# EAGLE design robosmoker (EAGLE 7.4.0)
http://github.com/robosmoker
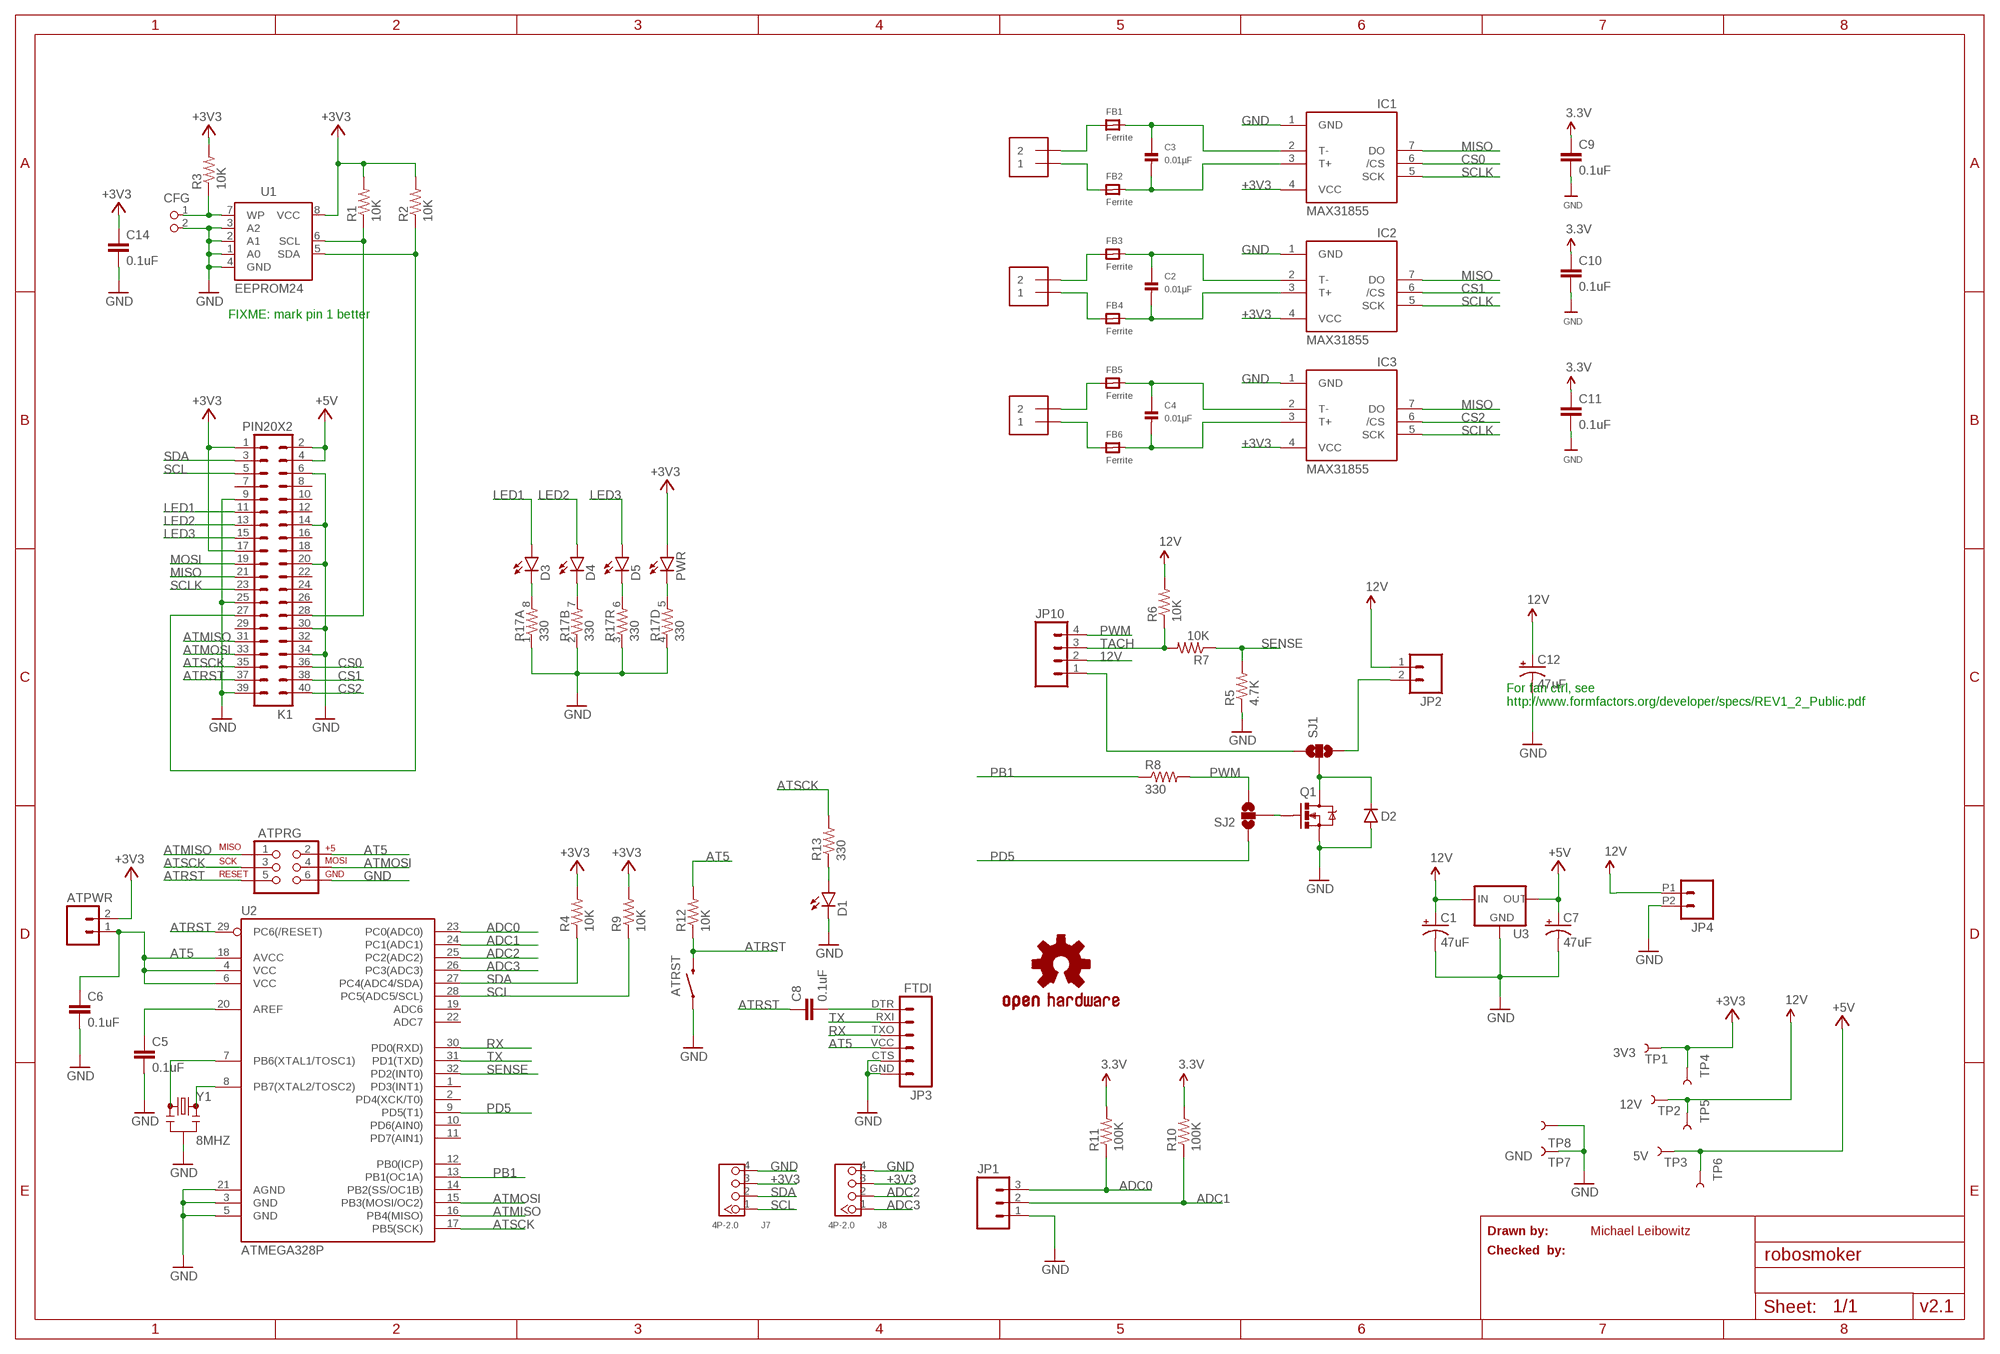
[diagram p0: schematic, sheet 1]

## Parts
ATPRG  AVR_SPI_PRG_62X3_LOCK  [2X3_LOCK]
ATPWR  M02LOCK  [1X02_LOCK]
ATRST  SWITCH-MOMENTARY-2PTH  [TACTILE-PTH]
C1  47uF  CAP_POL7343  [EIA7343]
C2  0.01µF  CAP_CERAMIC_0805  [_0805]
C3  0.01µF  CAP_CERAMIC_0805  [_0805]
C4  0.01µF  CAP_CERAMIC_0805  [_0805]
C5  0.1uF  0.1UF-25V(+80/-20%)(0603)  [0603-CAP]
C6  0.1uF  0.1UF-25V(+80/-20%)(0603)  [0603-CAP]
C7  47uF  CAP_POL7343  [EIA7343]
C8  0.1uF  0.1UF-25V(+80/-20%)(0603)  [0603-CAP]
C9  0.1uF  CAP0805  [0805]
C10  0.1uF  CAP0805  [0805]
C11  0.1uF  CAP0805  [0805]
C12  47uF  CAP_POL7343  [EIA7343]
C14  0.1uF  CAP0805  [0805]
CFG  PIN2_100  [PIN_W_2]
D1  LED0603  [LED-0603]
D2  250mA  DIODEBAS16  [SOD-323]
D3  LED0603  [LED-0603]
D4  LED0603  [LED-0603]
D5  LED0603  [LED-0603]
FB1  Ferrite  FERRITE_0805  [_0805]
FB2  Ferrite  FERRITE_0805  [_0805]
FB3  Ferrite  FERRITE_0805  [_0805]
FB4  Ferrite  FERRITE_0805  [_0805]
FB5  Ferrite  FERRITE_0805  [_0805]
FB6  Ferrite  FERRITE_0805  [_0805]
IC1  MAX31855  MAX6675  [SO08]
IC2  MAX31855  MAX6675  [SO08]
IC3  MAX31855  MAX6675  [SO08]
J1  1X2-3.5MM  [1X2-3.5MM]
J2  1X2-3.5MM  [1X2-3.5MM]
J3  1X2-3.5MM  [1X2-3.5MM]
J7  4P-2.0  GROVE-CONNECTOR-DIP(4P-2.0)  [HW4-2.0]
J8  4P-2.0  GROVE-CONNECTOR-DIP(4P-2.0)  [HW4-2.0]
JP1  M03SCREW  [SCREWTERMINAL-3.5MM-3]
JP2  M02POLAR_LOCK  [MOLEX-1X2_LOCK]
JP3  FTDI  FTDI_BASICPTH  [FTDI_BASIC]
JP4  M022.54MM_SCREWTERM  [1X02_2.54_SCREWTERM]
JP10  M04POLAR_LOCK  [MOLEX-1X4_LOCK]
K1  PIN20X2  [PIN_20X2]
LOGO1  OSHW-LOGOM  [OSHW-LOGO-M]
PWR  LED0603  [LED-0603]
Q1  NFET-FDD8780  MOSFET-NCHANNELFDD8780  [DPAK]
R1  10K  10KOHM-1/10W-1%(0603)0603  [0603-RES]
R2  10K  10KOHM-1/10W-1%(0603)0603  [0603-RES]
R3  10K  10KOHM-1/10W-1%(0603)0603  [0603-RES]
R4  10K  10KOHM-1/10W-1%(0603)0603  [0603-RES]
R5  4.7K  4.7KOHM-1/10W-1%(0603)  [0603-RES]
R6  10K  10KOHM-1/10W-1%(0603)0603  [0603-RES]
R7  10K  10KOHM-1/10W-1%(0603)0603  [0603-RES]
R8  330  RESISTOR0603  [0603-RES]
R9  10K  10KOHM-1/10W-1%(0603)0603  [0603-RES]
R10  100K  10KOHM-1/10W-1%(0603)0603  [0603-RES]
R11  100K  10KOHM-1/10W-1%(0603)0603  [0603-RES]
R12  10K  10KOHM-1/10W-1%(0603)0603  [0603-RES]
R13  330  RESISTOR0603  [0603-RES]
R17  330  RESISTOR-ARRAY0603-ARV  [0603-ARV]
SJ1  SOLDERJUMPER_2WAYS  [SJ_3]
SJ2  SOLDERJUMPER_2WAYS  [SJ_3]
TP1  3V3  TEST-POINT3X4  [PAD.03X.04]
TP2  12V  TEST-POINT3X4  [PAD.03X.04]
TP3  5V  TEST-POINT3X4  [PAD.03X.04]
TP4  3V3  TEST-POINTTP_15TH_THRU  [TP_15TH]
TP5  3V3  TEST-POINTTP_15TH_THRU  [TP_15TH]
TP6  3V3  TEST-POINTTP_15TH_THRU  [TP_15TH]
TP7  GND  TEST-POINT3X4  [PAD.03X.04]
TP8  3V3  TEST-POINTTP_15TH_THRU  [TP_15TH]
U1  EEPROM24  [SOIC8]
U2  ATMEGA328P  ATMEGA328P_TQFP  [TQFP32-08]
U3  V_REG_78XXSINK  [TO220-IGO]
Y1  8MHZ  RESONATOR8MHZ  [RESONATOR-SMD]

## Nets
12V [power]: C1.A(+) C12.A(+) JP2.1 JP4.P1 JP10.2 R6.2 TP2.P$1 TP5.P$1 U3.IN
+3V3 [power]: ATPWR.2 C9.1 C10.1 C11.1 C14.1 IC1.4(VCC) IC2.4(VCC) IC3.4(VCC) J7.3 J8.3 K1.1 K1.17 PWR.A R1.2 R2.2 R3.2 R4.2 R9.2 R10.2 R11.2 TP1.P$1 TP4.P$1 U1.8(VCC) ; supply symbol labelled 3.3V
+5V [power]: C7.A(+) K1.2 K1.4 TP3.P$1 TP6.P$1 U3.OUT
ADC0: JP1.3 R11.1 U2.23(PC0(ADC0))
ADC1: JP1.2 R10.1 U2.24(PC1(ADC1))
ADC2: J8.2 U2.25(PC2(ADC2))
ADC3: J8.1 U2.26(PC3(ADC3))
AT5 [power]: ATPRG.2 ATPWR.1 C6.1 JP3.VCC R12.2 U2.4(VCC) U2.6(VCC) U2.18(AVCC)
ATMISO: ATPRG.1 K1.31 U2.16(PB4(MISO))
ATMOSI: ATPRG.4 K1.33 U2.15(PB3(MOSI/OC2))
ATRST: ATPRG.5 ATRST.3 C8.1 K1.37 R12.1 U2.29(PC6(/RESET))
ATSCK: ATPRG.3 K1.35 R13.2 U2.17(PB5(SCK))
CS0: IC1.6(/CS) K1.36
CS1: IC2.6(/CS) K1.38
CS2: IC3.6(/CS) K1.40
GND [power]: ATPRG.6 ATRST.1 C1.C(-) C5.2 C6.2 C7.C(-) C9.2 C10.2 C11.2 C12.C(-) C14.2 CFG.2 D1.C D2.A IC1.1(GND) IC2.1(GND) IC3.1(GND) J7.4 J8.4 JP1.1 JP3.CTS JP3.GND JP4.P2 K1.6 K1.9 K1.14 K1.20 K1.25 K1.30 K1.34 K1.39 Q1.3(S) R5.1 R17.1 R17.2 R17.3 R17.4 TP7.P$1 TP8.P$1 U1.1(A0) U1.2(A1) U1.3(A2) U1.4(GND) U2.3(GND) U2.5(GND) U2.21(AGND) U3.GND Y1.2
LED1: D3.A K1.11
LED2: D4.A K1.13
LED3: D5.A K1.15
MISO: IC1.7(DO) IC2.7(DO) IC3.7(DO) K1.21
MOSI: K1.19
N$1: K1.28 R1.1 U1.6(SCL)
N$2: K1.27 R2.1 U1.5(SDA)
N$3: CFG.1 R3.1 U1.7(WP)
N$4: FB1.1 J1.2
N$5: C3.1 FB1.2 IC1.2(T-)
N$6: FB2.1 J1.1
N$7: C3.2 FB2.2 IC1.3(T+)
N$8: FB3.1 J2.2
N$9: C2.1 FB3.2 IC2.2(T-)
N$10: FB4.1 J2.1
N$11: C2.2 FB4.2 IC2.3(T+)
N$12: FB5.1 J3.2
N$13: C4.1 FB5.2 IC3.2(T-)
N$14: FB6.1 J3.1
N$15: C4.2 FB6.2 IC3.3(T+)
N$16 [power]: JP2.2 SJ1.3
N$17 [power]: JP10.1 SJ1.1
N$18: C5.1 U2.20(AREF)
N$19: C8.2 JP3.DTR
N$20: D1.A R13.1
N$21: D3.C R17.8
N$22 [power]: D2.C Q1.4(D) SJ1.2
N$23: D4.C R17.7
N$24: D5.C R17.6
N$25: Q1.1(G) SJ2.2
N$26: U2.7(PB6(XTAL1/TOSC1)) Y1.1
N$27: U2.8(PB7(XTAL2/TOSC2)) Y1.3
PB1: R8.1 U2.13(PB1(OC1A))
PD5: SJ2.1 U2.9(PD5(T1))
PWM: JP10.4 R8.2 SJ2.3
PWR: PWR.C R17.5
RX: JP3.TXO U2.30(PD0(RXD))
SCL: J7.1 K1.5 R9.1 U2.28(PC5(ADC5/SCL))
SCLK: IC1.5(SCK) IC2.5(SCK) IC3.5(SCK) K1.23
SDA: J7.2 K1.3 R4.1 U2.27(PC4(ADC4/SDA))
SENSE: R5.2 R7.1 U2.32(PD2(INT0))
TACH: JP10.3 R6.1 R7.2
TX: JP3.RXI U2.31(PD1(TXD))
Unconnected: K1.7 K1.8 K1.10 K1.12 K1.16 K1.18 K1.22 K1.24 K1.26 K1.29 K1.32 U2.1(PD3(INT1)) U2.2(PD4(XCK/T0)) U2.10(PD6(AIN0)) U2.11(PD7(AIN1)) U2.12(PB0(ICP)) U2.14(PB2(SS/OC1B)) U2.19(ADC6) U2.22(ADC7)

## Notes on the sheet
- FIXME: mark pin 1 better
- For fan ctrl, see
  http://www.formfactors.org/developer/specs/REV1_2_Public.pdf
- Drawn by: | Michael Leibowitz
- Checked  by:
- v2.1

## Library data of the parts
ATPRG = SparkFun-Connectors:AVR_SPI_PRG_6: AVR ISP 6 Pin This is the reduced ISP connector for AVR programming. Common on Arduino. This footprint will take up less PCB space and can be used with a 10-pin to 6-pin adapter such as SKU: BOB-08508 **Special note about "TEST_POINT" package. The stop mask is on the top side, so if you want your programming test points to be on the bottom of your board, make sure to place this package on the bottom side of the board. This also ensure that the orientation to program from the bottom side will be correct.
ATPWR JP2 JP4 = SparkFun-Connectors:M02: Standard 2-pin 0.1" header. Use with - straight break away headers ( PRT-00116) - right angle break away headers (PRT-00553) - swiss pins (PRT-00743) - machine pins (PRT-00117) - female headers (PRT-00115) Molex polarized connector foot print use with: PRT-08233 with associated crimp pins and housings. 2.54_SCREWTERM for use with PRT-10571. 3.5mm Screw Terminal footprints for PRT-08084 5mm Screw Terminal footprints for use with PRT-08432
ATRST = SparkFun-Electromechanical:SWITCH-MOMENTARY-2: Various NO switches- pushbuttons, reed, etc; PROD_ID: SWCH-08441
C1 C7 C12 = SparkFun-Capacitors:CAP_POL: Capacitor Polarized These are standard SMD and PTH capacitors. Normally 10uF, 47uF, and 100uF in electrolytic and tantalum varieties. Always verify the external diameter of the through hole cap, it varies with capacity, voltage, and manufacturer. The EIA devices should be standard.; PROD_ID: CAP-08702
C2-C4 = microbuilder:CAP_CERAMIC: Ceramic Capacitors 0402 - 0402 Surface Mount Capacitors 16pF 50V 5% [Digikey: 445-4899-2-ND] 18pF 50V 5% [Digikey: 490-1281-2-ND] 22pF 50V 5% [Digikey: 490-1283-2-ND] 68pF 50V 5% [Digikey: 490-1289-2-ND] 0.1uF 10V 10% [Digikey: 490-1318-2-ND] 1.0uF 6.3V 10% [Digikey: 490-1320-2-ND] 0603 - 0603 Surface Mount Capacitors 16 pF 50V 5% [Digikey: 445-5051-2-ND] 22 pF 50V [Digikey: PCC220ACVTR-ND] 33 pF 50V 5% [Digikey: 490-1415-1-ND] 56pF 50V 5% [Digikey: 490-1421-1-ND] 220pF 50V 5% [Digikey: 445-1285-1-ND] 680 pF 50V 2200 pF 50V 5% C0G [Digikey: 445-1297-1-ND] 5600 pF 100V 5% X7R [Digikey: 478-3711-1-ND] 0.1 µF 25V 10% [Digikey: PCC2277TR-ND] 0.22 µF 16V 10% X7R [Digikey: 445-1318-1-ND] 1.0 µF 25V 10% [Digikey: 445-5146-2-ND] 0603 - RF Specific 3pF 250V +/-0.1pF RF [Digikey: 712-1347-1-ND] 18 pF 250V 5% [Digikey: 478-3505-1-ND or 712-1322-1-ND] 56 pF 250V 5% C0G RF [Digikey: 490-4867-1-ND] 68 pF 250V RF [Digikey: 490-4868-1-ND] 0805 - 0805 Surface Mount Capacitors 220 pF 250V 2% RF Ceramic Capacitor [Digikey: 712-1398-1-ND] 1000 pF 50V 2% NP0 Ceramic Capacitor [Digikey: 478-3760-1-ND] 0.1 µF 25V 10% Ceramic Capacitor [Digikey: PCC1828TR-ND] 1.0 µF 16V 10% Ceramic Capacitor[Digikey: 490-1691-2-ND] 10.0 µF 10V 10% Ceramic Capacitor[Digikey: 709-1228-1-ND] 10.0 uF 16V 10% Ceramic Capacitor [Digikey: 478-5165-2-ND] 47 uF 6.3V 20% Ceramic Capacitor [Digikey: 587-1779-1-ND or 399-5506-1-ND] 1206 - 1206 Surface Mount Capacitors 47uF 10V 20% Ceramic Capacitor [Digikey: 490-5528-1-ND or 399-5508-1-ND or 445-6010-1-ND] 100uF 6.3V -20%, +80% Y5V Ceramic Capacitor (Digikey: 490-4512-1-ND, Mouser: 81-GRM31CF50J107ZE1L)
C5 C6 C8 = SparkFun-Capacitors:0.1UF-25V(+80/-20%)(0603): CAP-00810 Ceramic Standard decoupling cap; PROD_ID: CAP-00810
C9-C11 C14 = SparkFun-Passives:CAP: Capacitor Standard 0603 ceramic capacitor, and 0.1" leaded capacitor.
CFG = FLYFISH:PIN2
D1 D3-D5 PWR = SparkFun-LED:LED: LEDs Standard schematic elements and footprints for 5mm, 3mm, 1206, and 0603 sized LEDs. 5mm - Spark Fun Electronics SKU : COM-00529 (and others)
D2 = SparkFun-DiscreteSemi:DIODE: Diode These are standard reverse protection diodes and small signal diodes. SMA package can handle up to about 1A. SOD-323 can handle about 200mA. What the SOD-323 package when ordering, there are some mfgs out there that are 5-pin packages.; PROD_ID: DIO-09646; VALUE: 250mA/100V
FB1-FB6 = microbuilder:FERRITE: Ferrite Bead 0603 MMZ1608B121C - 120 Ohm @ 100MHz, 600mA, 0.15 Ohm DC Resistance - Digikey: 445-2164-1-ND BK1608HW121-T - 120 Ohm, 600mA Ferrite Chip - Digikey: 587-1876-2-ND 0805 HZ0805B272R-10 - 2.7K Ohm @ 100MHz, 200mA, 0.8 Ohm DC Resistance - Digikey: 240-2504-1-ND (see also Murata BLM21BD272SN1L) MMZ2012Y152B - 1.5K Ohm @ 100MHz, 500mA, 0.4 Ohm DC Resistance - Digikey: 445-1560-1-ND - Mainly for high frequency (80-400MHz) MMZ2012R102A - 1K Ohm @ 100MHz, 500mA, 0.3 Ohm DC Resistance - Digikey: 445-1555-2-ND - More general purpose (10-200MHz)
IC1-IC3 = adafruit:MAX6675
J1-J3 = adafruit:1X2: 3.5mm Terminal block http://www.ladyada.net/library/pcb/eaglelibrary.html
J7 J8 = Seeed-OPL-Connector:GROVE-CONNECTOR-DIP(4P-2.0): 320110033
JP1 = SparkFun-Connectors:M03: Header 3 Standard 3-pin 0.1" header. Use with straight break away headers (SKU : PRT-00116), right angle break away headers (PRT-00553), swiss pins (PRT-00743), machine pins (PRT-00117), and female headers (PRT-00115). Molex polarized connector foot print use with SKU : PRT-08232 with associated crimp pins and housings.; PROD_ID: CONN-08288
JP3 = SparkFun-Connectors:FTDI_BASIC: FTDI Basic header with labels
JP10 = SparkFun-Connectors:M04: Header 4 Standard 4-pin 0.1" header. Use with straight break away headers (SKU : PRT-00116), right angle break away headers (PRT-00553), swiss pins (PRT-00743), machine pins (PRT-00117), and female headers (PRT-00115). Molex polarized connector foot print use with SKU : PRT-08231 with associated crimp pins and housings. 1MM SMD Version SKU: PRT-10208
K1 = FLYFISH:PIN20X2
LOGO1 = SparkFun-Aesthetics:OSHW-LOGO: Open Source Hardware Logo This logo indicates the piece of hardware it is found on incorporates a OSHW license and/or adheres to the definition of open source hardware found here: http://freedomdefined.org/OSHW
Q1 = SparkFun-DiscreteSemi:MOSFET-NCHANNEL: Common NMOSFET Parts MFG P/N Store ID Prod ID FDD8780 TRANS-09984 SI7820DN TRANS-11055 FDS6630A IC-08089 2N7002PW TRANS-11151 FQP30N06L COM-10213 TRANS-10060 BSS123LT1G TRANS-08345 BSS138 TRANS-00830 BS170 2N7000; PROD_ID: TRANS-09984
R1-R4 R6 R7 R9 R12 = SparkFun-Resistors:10KOHM-1/10W-1%(0603): RES-00824; PROD_ID: RES-00824
R5 = SparkFun-Resistors:4.7KOHM-1/10W-1%(0603): RES-07857; PROD_ID: RES-07857
R8 R13 = SparkFun-Resistors:RESISTOR: Resistor Basic schematic elements and footprints for 0603, 1206, and PTH resistors.
R10 R11 = SparkFun-Resistors:10KOHM-1/10W-1%(0603): RES-00824; PROD_ID: RES-00824; VALUE: 10K
R17 = SparkFun-Resistors:RESISTOR-ARRAY: Array Chip Resistor Source: RS Component / Phycomp
SJ1 SJ2 = SparkFun-Retired:SOLDERJUMPER_2WAY: Solder Jumper 2 way solder jumper
TP1-TP8 = SparkFun-Passives:TEST-POINT: Bare copper test points for troubleshooting or ICT
U1 = FLYFISH:EEPROM24
U2 = SparkFun-DigitalIC:ATMEGA328P_TQFP; PROD_ID: IC-09069; VALUE: ATMEGA328P_TQFP
U3 = SparkFun-PowerIC:V_REG_78XX: Voltage Regulator Standard 78xx regulator. IGO (Input Ground Output). Spark Fun Electronics SKU : COM-00107
Y1 = SparkFun-FreqCtrl:RESONATOR: Resonator Small SMD resonator. Used, eg, on the Arduino Pro/ Pro Mini boards. 8MHz- XTAL-08895 16MHz- XTAL-08900; PROD_ID: XTAL-08895

## Net classes
1 power: width 0.305 mm

## Board
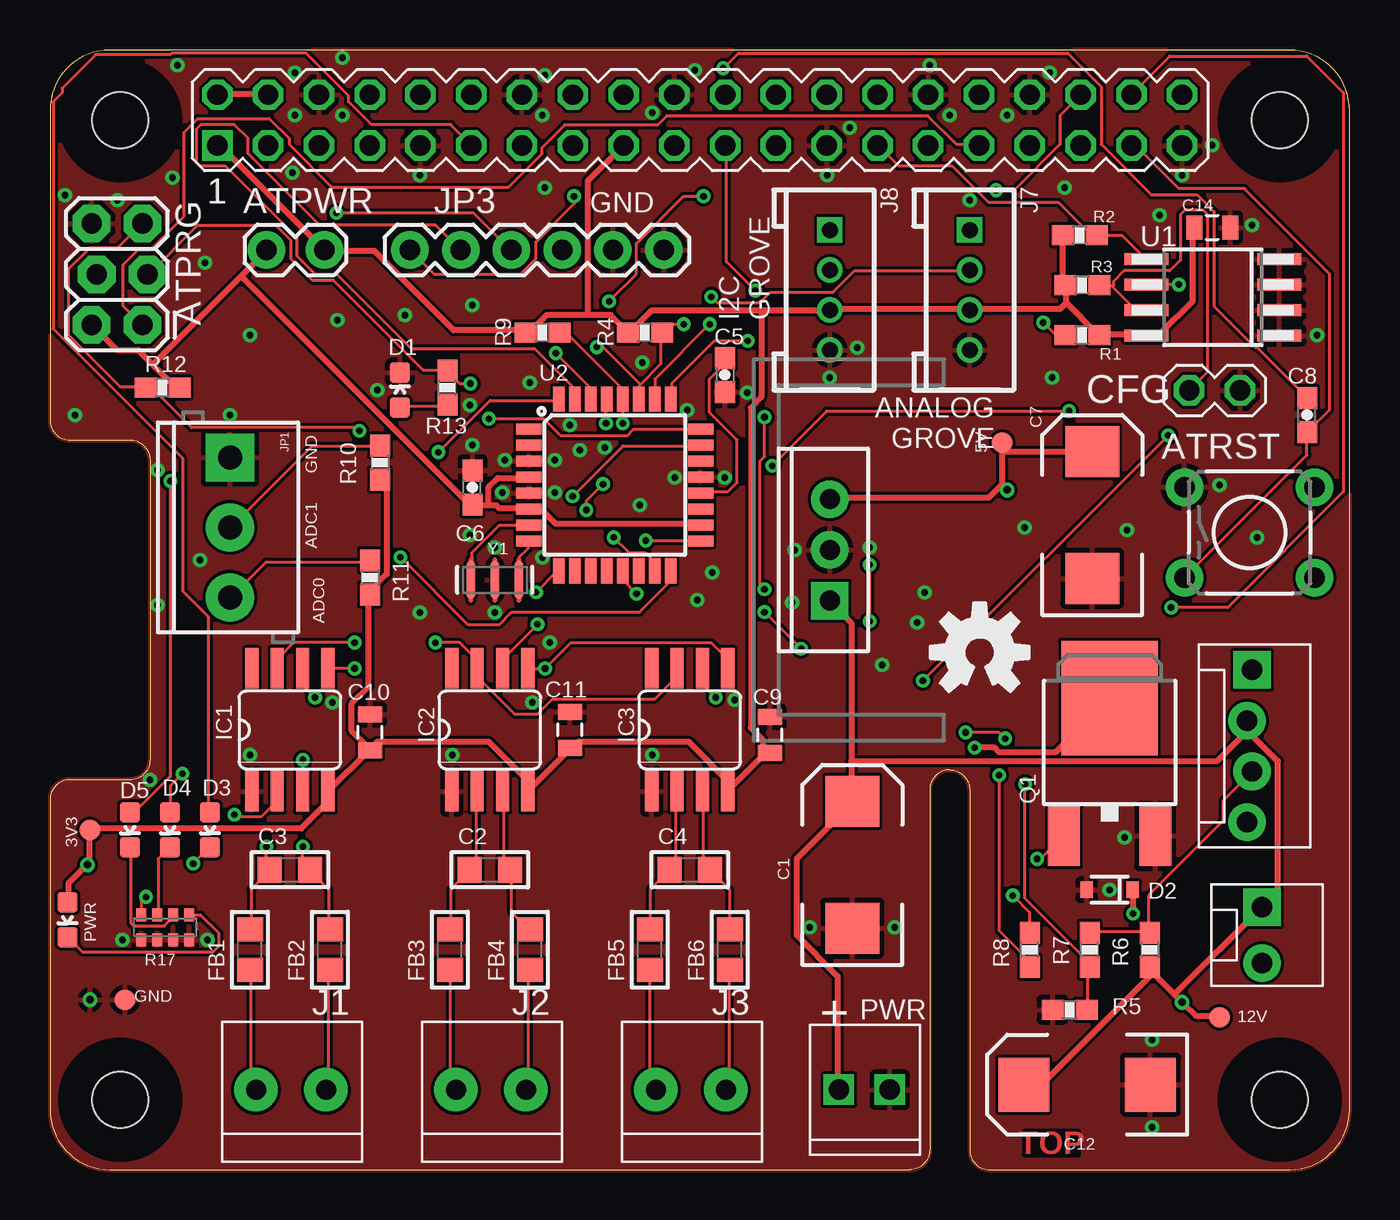
[diagram p1: board, top side]
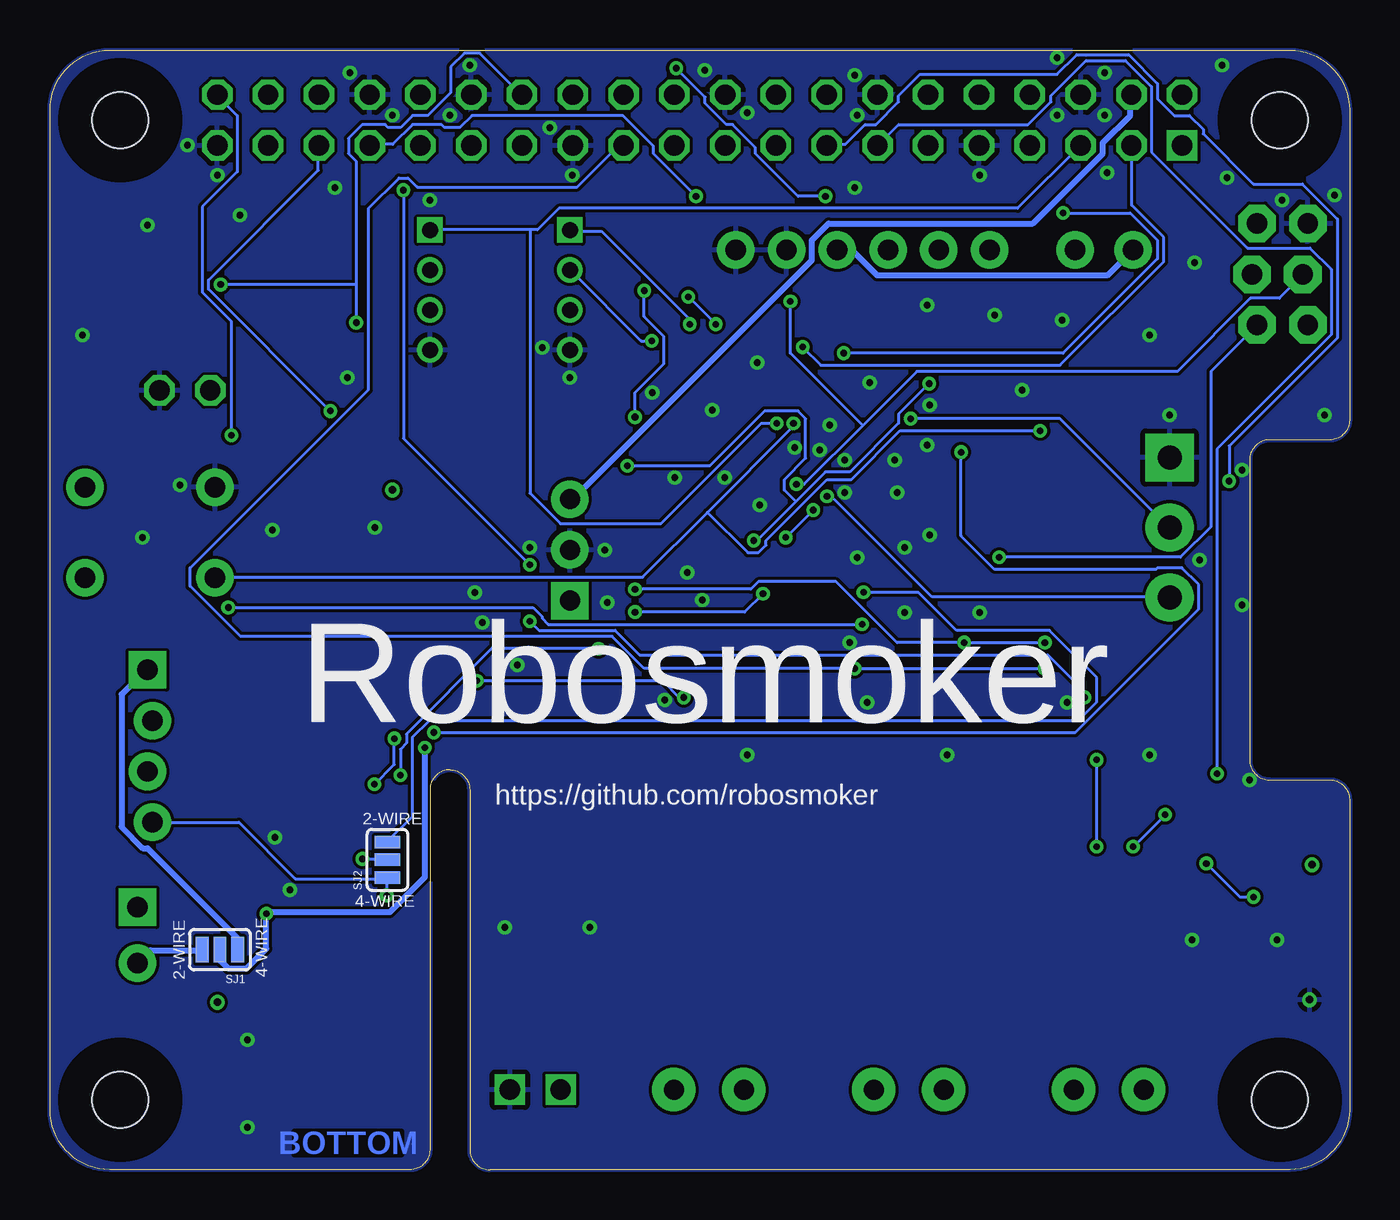
[diagram p2: board, bottom side, seen from below]

Size 65 x 56 mm. Coordinates in mm from the lower left corner, seen from the top.
Outline: 0,3 arc90 3,0 43,0 arc90 44,1 44,19 arc-90 45,20 arc-90 46,19 46,1 arc90 47,0 62,0 arc90 65,3 65,53 arc90 62,56 3,56 arc90 0,53 0,37.5 arc90 1,36.5 4,36.5 arc-90 5,35.5 5,20.5 arc-90 4,19.5 1,19.5 arc90 0,18.5 0,3
Copper layers (1*16): Top 0.0356mm / dielectric 1.5011mm / Bottom 0.0356mm
Design rules "LaenPCBOrder *": minimum track width 6mil, minimum drill 13mil, track to track 6mil, track to pad 6mil, pad to pad 6mil, via to via 6mil, smd to smd 6mil, copper to edge 0mil, drill to drill 6mil, minimum pad ring 7mil, minimum via ring 7mil, stop-mask expansion 3mil, vias tented up to drill 15mil, thermal gap 10mil
Holes 2.8 mm at 3.5,3.5 3.5,52.5 61.5,52.5 61.5,3.5
tRestrict: area 1.9,51 to 5,54; area 60,51 to 63,54; area 60,1.9 to 63,5; area 1.9,1.9 to 5,5
bRestrict: area 1.9,1.9 to 5,5; area 1.9,51 to 5,54; area 60,1.9 to 63,5; area 60,51 to 63,54

### Footprints (pad centres in the part's own frame; a part is rotated, then mirrored left to right if it is on the bottom)
2X3_LOCK = drill 1.016 pad 1.88 octagon: 1 0,0; 2 0,2.54; 3 2.54,-0.254; 4 2.54,2.286; 5 5.08,0; 6 5.08,2.54
1X02_LOCK = drill 1.016 pad 1.88: 1 -0.178,0; 2 2.718,0
TACTILE-PTH = drill 1.016 pad 1.88: 1 -3.251,2.261; 2 3.251,2.261; 3 -3.251,-2.261; 4 3.251,-2.261
EIA7343 = smd 2.55 x 2.7: A 3.17,0; C -3.17,0
_0805 = smd 1.2 x 1.3: 1 -1.016,0; 2 1.016,0
0603-CAP = smd 1.1 x 1: 1 -0.85,0; 2 0.85,0
0805 = smd 0.8 x 1.2: 1 -0.9,0; 2 0.9,0
PIN_W_2 = drill 1.016 octagon: 1 0,0; 2 0,-2.54
LED-0603 = smd 1 x 1: A 0,-0.877; C 0,0.877
SOD-323 = smd 0.63 x 0.83: A 1.15,0; C -1.15,0
SO08 = smd 0.66 x 2.032: 1 -1.905,-3.073; 2 -0.635,-3.073; 3 0.635,-3.073; 4 1.905,-3.073; 5 1.905,3.073; 6 0.635,3.073; 7 -0.635,3.073; 8 -1.905,3.073
1X2-3.5MM = drill 1 pad 2.184: 1 1.8,0; 2 -1.7,0
HW4-2.0 = drill 0.8 pad 1.27 square: 1 -3,0 | drill 0.8 pad 1.27: 2 -1,0; 3 1,0; 4 3,0
SCREWTERMINAL-3.5MM-3 = drill 1.2 pad 2.413 square: 1 0,0 | drill 1.2 pad 2.413: 2 3.5,0; 3 7,0
MOLEX-1X2_LOCK = drill 1.016 pad 1.88 square: 1 -0.127,0 | drill 1.016 pad 1.88: 2 2.667,0
FTDI_BASIC = drill 1.016 pad 1.88: CTS 10.16,0; DTR 0,0; GND 12.7,0; RXI 2.54,0; TXO 5.08,0; VCC 7.62,0
1X02_2.54_SCREWTERM = drill 1.016 square: P1 2.54,0; P2 0,0
MOLEX-1X4_LOCK = drill 1.016 pad 1.88 square: 1 0,0.127 | drill 1.016 pad 1.88: 2 2.54,-0.127; 3 5.08,0.127; 4 7.62,-0.127
PIN_20X2 = drill 1.016 square: 1 -24.13,-1.27 | drill 1.016 octagon: 2 -24.13,1.27; 3 -21.59,-1.27; 4 -21.59,1.27; 5 -19.05,-1.27; 6 -19.05,1.27; 7 -16.51,-1.27; 8 -16.51,1.27; 9 -13.97,-1.27; 10 -13.97,1.27; 11 -11.43,-1.27; 12 -11.43,1.27; 13 -8.89,-1.27; 14 -8.89,1.27; 15 -6.35,-1.27; 16 -6.35,1.27; 17 -3.81,-1.27; 18 -3.81,1.27; 19 -1.27,-1.27; 20 -1.27,1.27; 21 1.27,-1.27; 22 1.27,1.27; 23 3.81,-1.27; 24 3.81,1.27; 25 6.35,-1.27; 26 6.35,1.27; 27 8.89,-1.27; 28 8.89,1.27; 29 11.43,-1.27; 30 11.43,1.27; 31 13.97,-1.27; 32 13.97,1.27; 33 16.51,-1.27; 34 16.51,1.27; 35 19.05,-1.27; 36 19.05,1.27; 37 21.59,-1.27; 38 21.59,1.27; 39 24.13,-1.27; 40 24.13,1.27
DPAK = smd 1.6 x 3: 1 -2.28,-5.31; 3 2.28,-5.31 | smd 4.826 x 5.715: 4 0,1.588
0603-RES = smd 1.1 x 1: 1 -0.85,0; 2 0.85,0
0603-ARV = smd 0.5 x 0.65: 1 -1.2,-0.625; 2 -0.4,-0.625; 3 0.4,-0.625; 4 1.2,-0.625; 5 1.2,0.625; 6 0.4,0.625; 7 -0.4,0.625; 8 -1.2,0.625
SJ_3 = smd 0.635 x 1.27: 1 -0.889,0; 2 0,0; 3 0.889,0
PAD.03X.04 = smd 1.016 x 1.016: P$1 0,0
TP_15TH = drill 0.381 pad 0.61: P$1 0,0
SOIC8 = smd 0.6 x 2.2: 1 -1.905,-3.33; 2 -0.635,-3.33; 3 0.635,-3.33; 4 1.905,-3.33; 5 1.905,3.33; 6 0.635,3.33; 7 -0.635,3.33; 8 -1.905,3.33
TQFP32-08 = smd 1.27 x 0.559: 1 -4.293,2.8; 2 -4.293,2; 3 -4.293,1.2; 4 -4.293,0.4; 5 -4.293,-0.4; 6 -4.293,-1.2; 7 -4.293,-2; 8 -4.293,-2.8; 17 4.293,-2.8; 18 4.293,-2; 19 4.293,-1.2; 20 4.293,-0.4; 21 4.293,0.4; 22 4.293,1.2; 23 4.293,2; 24 4.293,2.8 | smd 0.559 x 1.27: 9 -2.8,-4.293; 10 -2,-4.293; 11 -1.2,-4.293; 12 -0.4,-4.293; 13 0.4,-4.293; 14 1.2,-4.293; 15 2,-4.293; 16 2.8,-4.293; 25 2.8,4.293; 26 2,4.293; 27 1.2,4.293; 28 0.4,4.293; 29 -0.4,4.293; 30 -1.2,4.293; 31 -2,4.293; 32 -2.8,4.293
TO220-IGO = drill 1 pad 1.88: GND 0,0; OUT 2.54,0 | drill 1 pad 1.88 square: IN -2.54,0
RESONATOR-SMD = smd 0.45 x 1.905: 1 -1.2,0; 2 0,0; 3 1.2,0

### Placement (x,y rotation side)
ATPRG  4.62,42.25 90 top
ATPWR  11,46 0 top
ATRST  60,31.88 0 top
C1  40.12,15.25 90 top
C2  22,15 0 top
C3  12,15 0 top
C4  32,15 0 top
C5  33.75,39.75 270 top
C6  21.12,34.12 90 top
C7  52.12,32.75 90 top
C8  62.88,37.75 90 top
C9  36,21.75 90 top
C10  16,21.88 90 top
C11  26,22 90 top
C12  51.88,4.25 180 top
C14  58.12,47.12 0 top
CFG  56.98,38.98 90 top
D1  17.5,39 0 top
D2  53,14 180 top
D3  8,17 180 top
D4  6,17 180 top
D5  4,17 180 top
FB1  10,11 90 top
FB2  14,11 90 top
FB3  20,11 90 top
FB4  24,11 90 top
FB5  30,11 90 top
FB6  34,11 90 top
IC1  12,22 0 top
IC2  22,22 0 top
IC3  32,22 0 top
J1  12,4 0 top
J2  22,4 0 top
J3  32,4 0 top
J7  46,44 270 top
J8  39,44 270 top
JP1  9,35.62 270 top
JP2  60.62,13 270 top
JP3  18,46 0 top
JP4  42,4 180 top
JP10  60,25 270 top
K1  32.5,52.5 0 top
LOGO1  46.5,25.88 0 top
PWR  0.88,12.5 180 top
Q1  53,22 0 top
R1  51.62,41.75 0 top
R2  51.5,46.75 180 top
R3  51.62,44.25 180 top
R4  29.75,41.88 180 top
R5  51,8 0 top
R6  55,11 270 top
R7  52,11 90 top
R8  49,11 90 top
R9  24.62,41.88 180 top
R10  16.5,35.38 270 top
R11  16,29.62 270 top
R12  5.62,39.12 0 top
R13  19.88,39.12 90 top
R17  5.75,12.12 0 top
SJ1  56.5,11 180 bottom
SJ2  48.12,15.5 270 bottom
TP1  2,17 0 top
TP2  58.5,7.62 0 top
TP3  47.62,36.38 0 top
TP4  1.88,15.25 0 top
TP5  56.62,8.38 0 top
TP6  47.88,34 0 top
TP7  3.75,8.5 0 top
TP8  2,8.5 0 top
U1  58.16,43.63 90 top
U2  28.25,34.25 0 top
U3  39,31 90 top
Y1  22.25,29.5 0 top

### Tracks (layer width: path | path; a pad name or v marks a point on that pad's centre or on a via)
12V
  Top 0.305: 40.08,20.42 40.08,27.36 39.01,28.42 U3.IN | 40.08,20.42 40.08,18.44 C1.A 40.08,18.29 37.34,15.54 37.34,11.73 39.4,9.68 39.4,4.04 JP4.P1 | TP2.P$1 58.45,7.7 57.3,7.7 56.69,8.31 TP5.P$1 56.54,8.46 56.24,8.76 | 56.24,8.76 55.02,9.98 55.02,10.13 R6.2 55.09,9.75 49.61,4.27 48.77,4.27 C12.A | 56.24,8.76 60.58,13.11 JP2.1 60.66,13.26 61.42,14.02 61.42,20.42 59.89,21.95 59.89,22.4 JP10.2 59.82,21.87 58.37,20.42 40.08,20.42
+3V3
  Top 0.305: R10.2 16.54,34.52 16.84,34.21 16.84,29.79 16,28.96 16,28.8 R11.2 15.93,28.65 15.93,24.16 15.09,23.32 15.09,21.95 15.93,21.11 C10.1 | PWR.A 0.91,13.41 0.91,14.33 1.83,15.24 TP4.P$1 1.98,15.32 1.98,16.99 TP1.P$1 2.13,17.07 12.57,17.07 13.87,18.36 13.87,18.82 IC1.4 13.95,18.97 15.93,20.95 C10.1 | C10.1 16.08,21.11 16.38,21.41 21.95,21.41 24.08,19.28 IC2.4 23.93,18.97 25.98,21.03 C11.1 26.14,21.11 26.44,21.41 31.93,21.41 34.06,19.28 IC3.4 33.91,18.97 35.74,20.8 35.97,20.8 C9.1 35.66,20.88 35.66,21.49 35.05,22.1 35.05,38.1 35.59,38.63 35.59,42.98 | K1.1 8.38,51.21 8.53,51.21 13.72,46.02 ATPWR.2 13.87,45.95 16.23,45.95 20.19,41.99 23.7,41.99 R9.2 23.85,41.91 24,41.91 24.84,42.75 26.9,42.75 | 26.9,42.75 28.04,42.75 28.88,41.91 R4.2 29.03,41.91 30.1,42.98 35.59,42.98 | 26.9,42.75 26.9,49.45 28.65,51.21 K1.17 | R2.2 50.67,46.71 50.67,44.35 50.75,44.27 R3.2 50.83,44.12 50.83,43.36 | C14.1 57.15,47.09 57.15,43.43 55.55,41.83 54.94,41.83 U1.8 54.79,41.76 52.5,41.76 R1.2 52.35,41.83 50.83,43.36 | 50.83,43.36 50.52,43.05 46.1,43.05 J7.3 45.95,43.05 39.01,43.05 J8.3 38.86,42.98 35.59,42.98
+5V
  Top 0.305: K1.2 8.38,53.8 10.9,53.8 K1.4 | 47.62,34.29 TP3.P$1 47.7,35.89 52.12,35.89 C7.A | 47.62,34.29 47.85,34.06 TP6.P$1 | 47.62,34.29 46.94,33.6 39.01,33.6 U3.OUT
  Bottom 0.305: K1.4 10.97,53.72 10.97,52.73 12.34,51.36 12.34,50.83 15.85,47.32 26.06,47.32 26.9,46.48 26.9,45.49 38.79,33.6 38.94,33.6 U3.OUT
ADC0  (via drill 0.33)
  Top 0.152: R11.1 15.93,30.4 10.82,30.4 9.07,28.65 JP1.3 | v26.14,33.68 28.65,36.2 32.54,36.2 U2.23
  Bottom 0.152: v26.14,33.68 25.91,33.68 20.88,28.65 9.07,28.65 JP1.3
ADC1  (via drill 0.33)
  Top 0.152: R10.1 16.46,36.2 13.11,36.2 9.07,32.16 JP1.2 | v21.95,37.57 24.69,37.57 25.53,36.73 28.88,36.73 29.18,37.03 32.54,37.03 U2.24
  Bottom 0.152: v21.95,37.57 14.48,37.57 9.07,32.16 JP1.2
ADC2  (via drill 0.33)
  Top 0.152: v34.9,41.45 33.22,41.45 31.09,39.32 31.09,38.56 U2.25
  Bottom 0.152: v34.9,41.45 35.43,41.45 38.94,44.96 J8.2
ADC3  (via drill 0.33)
  Top 0.152: v32.99,42.29 30.25,39.55 30.25,38.56 U2.26
  Bottom 0.152: v32.99,42.29 32.99,42.52 37.41,46.94 38.94,46.94 J8.1
AT5
  Top 0.305: 21.95,33.22 22.33,33.22 22.48,33.07 23.93,33.07 U2.6 24.08,32.99 24.61,32.99 25.3,32.31 32.54,32.31 U2.18 | 21.95,33.22 21.18,33.22 C6.1 21.03,33.38 20.88,33.38 9.56,44.69 | 21.95,33.22 21.95,34.14 22.4,34.59 23.93,34.59 U2.4 | 5.14,40.27 4.42,41 3.35,41 2.13,42.22 ATPRG.2 | 5.14,40.27 6.25,39.17 6.4,39.17 R12.2 | 5.14,40.27 9.56,44.69 | 9.56,44.69 10.82,45.95 ATPWR.1
  Bottom 0.305: JP3.VCC 25.6,45.95 24.84,45.95 23.62,44.73 12.12,44.73 10.9,45.95 ATPWR.1
ATMISO  (via drill 0.33)
  Top 0.152: v17.53,30.63 20.88,27.28 22.48,27.28 23.09,27.89 29.49,27.89 31.01,29.41 31.01,29.95 U2.16 | K1.31 46.41,51.28 45.34,51.28 43.89,52.73 30.86,52.73 30.4,52.27 25.76,52.27 24.61,51.13 24.61,50.83 22.94,49.15 14.1,49.15 11.96,51.28 11.96,51.59 10.97,52.58 7.39,52.58 6.71,51.89 6.71,47.7 5.03,46.02 4.42,46.02 3.66,45.26 3.66,43.2 4.57,42.29 ATPRG.1
  Bottom 0.152: v17.53,30.63 8.46,30.63 6.93,32.16 6.93,39.93 4.65,42.22 ATPRG.1
ATMOSI  (via drill 0.33)
  Top 0.152: v28.19,31.62 28.96,30.86 29.79,30.86 30.18,30.48 30.18,30.02 U2.15 | v26.82,32.99 26.82,33.45 v27.66,34.29 | v32.69,48.69 31.7,48.69 29.34,46.33 29.34,44.81 v27.96,43.43
  Bottom 0.152: v26.82,32.99 v28.19,31.62 | v27.66,34.29 27.28,34.29 24.35,37.22 | 24.35,37.22 21.64,39.93 8.61,39.93 4.95,43.59 3.5,43.59 2.36,44.73 ATPRG.4 | v32.69,48.69 34.82,50.83 34.82,51.21 36.35,52.73 43.89,52.73 44.5,52.12 45.26,52.12 45.41,52.27 46.86,52.27 47.85,51.28 49,51.28 K1.33 | v27.96,43.43 27.96,40.84 24.35,37.22
ATRST  (via drill 0.33)
  Top 0.152: ATPRG.5 4.57,47.32 3.35,46.1 1.98,46.1 0.91,45.03 0.91,41.76 3.5,39.17 4.72,39.17 R12.1 4.8,39.09 5.11,39.09 7.09,37.11 15.32,37.11 v15.47,36.96 | ATRST.3 56.77,29.64 62.87,35.74 62.87,36.88 C8.1 62.94,36.96 64.01,38.02 64.01,44.81 59.74,49.07 56.46,49.07 54.33,51.21 54.1,51.21 K1.37 | v27.81,37.34 27.81,38.48 U2.29
  Bottom 0.152: v27.81,37.34 27.81,37.19 32.12,32.88 | 32.12,32.88 35.36,29.64 56.69,29.64 ATRST.3 | v15.47,36.96 22.48,36.96 24.92,34.52 26.14,34.52 29.18,31.47 29.18,31.24 29.57,30.86 30.1,30.86 32.12,32.88
ATSCK  (via drill 0.33)
  Top 0.152: ATPRG.3 4.95,44.81 7.39,47.24 11.28,47.24 12.04,46.48 12.04,45.57 13.11,44.5 14.17,44.5 18.67,40.01 19.81,40.01 R13.2 19.89,39.93 20.5,39.32 v21.03,39.32 | v29.79,31.47 32.54,31.47 U2.17 | v50.98,37.95 38.86,37.95 v36.12,35.2
  Bottom 0.152: v29.79,31.47 29.64,31.47 27.7,33.41 | 27.7,33.41 26.21,34.9 24.99,34.9 22.55,37.34 22.55,37.8 v21.03,39.32 | v50.98,37.95 57.07,44.04 57.07,44.5 51.59,49.99 51.59,51.21 K1.35 | v36.12,35.2 32,35.2 29.26,37.95 27.58,37.95 27.2,37.57 27.2,35.59 28.27,34.52 28.27,33.98 27.7,33.41
CS0  (via drill 0.33)
  Top 0.152: v13.26,23.62 12.65,24.23 12.65,25.07 IC1.6 | v41,30.25 v41,27.43 | v47.32,49 48.23,49 50.52,51.28 50.52,52.73 51.51,53.72 K1.36
  Bottom 0.152: v13.26,23.62 13.26,23.93 15.09,25.76 35.51,25.76 36.73,26.98 40.54,26.98 v41,27.43 | v41,30.25 47.32,36.58 v47.32,49
CS1  (via drill 0.33)
  Top 0.152: v24.38,27.28 22.71,25.6 22.71,25.15 IC2.6 | v56.08,28.12 58.9,28.12 64.69,33.91 64.69,53.87 62.87,55.7 56.01,55.7 54.1,53.8 K1.38
  Bottom 0.152: v24.38,27.28 40.08,27.28 40.39,27.58 40.39,27.66 40.84,28.12 v56.08,28.12
CS2  (via drill 0.33)
  Top 0.152: v33.3,23.62 32.69,24.23 32.69,25.07 IC3.6 | v55.93,36.73 v43.66,24.46
  Bottom 0.152: v33.3,23.62 33.53,23.62 34.37,24.46 v43.66,24.46 | v55.93,36.73 55.93,42.44 57.38,43.89 57.38,48.16 55.63,49.91 55.63,52.73 56.62,53.72 K1.40
GND  (via drill 0.34)
  other vias: 1.25,37.75 0.75,48.75 3.38,48.5 12.25,54.88 12.25,52.75 14.62,52.75 14.62,55.62 18.5,49.75 24.75,54.75 24.62,52.75 30.12,52.88 32.25,55 38.88,49.75 40,52.12 44,55.25 45,52.75 47.88,52.75 50,54.88 58.12,51.25 56.62,49.75 25.25,33.88 22.62,33.88 22.75,35.5 25.25,35.5 21.12,36.25 33.75,34.62 31.25,34.62 22.25,27.88 22.25,31.12 24.62,30.62 31.88,38 34.88,38.88 39,39.62 40.38,41.12 41,31.12 37.25,31 34.25,23.5 30.12,20.75 24.12,23.38 20.12,20.75 14.12,23.38 10,20.75 3.62,11.5 7.88,11.5 5,19.5 5.38,28.25 5.38,35 9,37.75 53,14 53.75,16.62 55.12,2.12 42.25,12.12 38,12.12 55.12,6.5 58.5,34.25 60.12,47.25 63.38,41.75 46,48.5 6.12,49.62 6.38,55.25 12.12,49.88 29.62,40.38 24,39.38 21.12,43.25 17.75,42.75 14.38,42.5 10,41.75 7.75,45.38 16.38,39 7.5,30.5 53.88,32 48.75,32.12 50.12,39.62 55.5,47.75 50.75,49.12 24.75,49.12 26,37.25 27.75,36.12 29.5,33.25 26.5,36 21,38.25 21,31.75 25,26.38 32.38,28.5 37.12,28.38 33.12,29.88 18.5,27.88 43.75,28.88 41.62,25.25 43.38,27.38 60.38,31.62
  pour Bottom: 0,3 arc90 3,0 43,0 arc90 44,1 44,19 arc-90 45,20 arc-90 46,19 46,1 arc90 47,0 62,0 arc90 65,3 65,53 arc90 62,56 3,56 arc90 0,53 0,37.5 arc90 1,36.5 4,36.5 arc-90 5,35.5 5,20.5 arc-90 4,19.5 1,19.5 arc90 0,18.5
  pour Top: 0,3 arc90 3,0 43,0 arc90 44,1 44,19 arc-90 45,20 arc-90 46,19 46,1 arc90 47,0 62,0 arc90 65,3 65,53 arc90 62,56 3,56 arc90 0,53 0,37.5 arc90 1,36.5 4,36.5 arc-90 5,35.5 5,20.5 arc-90 4,19.5 1,19.5 arc90 0,18.5
LED1
  Top 0.152: D3.A 7.92,17.91 7.92,27.66 6.63,28.96 6.63,35.59 0.15,42.06 0.15,53.42 0.61,53.87 0.61,54.1 2.29,55.78 6.02,55.78 6.1,55.85 12.8,55.85 14.94,53.72 14.94,53.42 16.08,52.27 20.04,52.27 21.03,51.28 K1.11
LED2  (via drill 0.33)
  Top 0.152: v6.63,19.81 6.02,19.2 6.02,17.91 D4.A
  Bottom 0.152: v6.63,19.81 6.63,36.04 0.91,41.76 0.91,45.03 1.98,46.1 5.11,46.1 9.91,50.9 9.91,54.18 11.2,55.47 13.18,55.47 14.94,53.72 14.94,53.42 16.08,52.27 22.55,52.27 23.55,51.28 K1.13
LED3  (via drill 0.33)
  Top 0.152: v6.02,34.44 6.02,19.66 4.27,17.91 4.04,17.91 D5.A
  Bottom 0.152: v6.02,34.44 6.02,36.2 0.61,41.6 0.61,47.55 2.36,49.3 4.8,49.3 7.32,51.82 7.32,52.05 8,52.73 8.76,52.73 9.6,53.57 9.6,54.33 11.05,55.78 13.64,55.78 14.63,54.79 21.49,54.79 22.55,53.72 22.55,53.42 23.7,52.27 24.23,52.27 25.22,51.28 26.14,51.28 K1.15
MISO  (via drill 0.33)
  Top 0.152: v15.24,26.36 12.19,26.36 11.43,25.6 11.43,25.15 IC1.7 | v19.28,26.36 20.5,26.36 21.34,25.53 21.34,25.15 IC2.7 21.41,25.07 21.41,24.61 23.24,22.78 24.38,22.78 25.15,23.55 30.25,23.55 31.32,24.61 31.32,25.07 IC3.7 | v35.28,43.97 33.83,45.41 33.83,51.21 K1.21 | v35.74,37.64 35.74,35.66 35.51,35.43 35.51,29.26 v35.74,29.03
  Bottom 0.152: v15.24,26.36 v19.28,26.36 22.63,26.36 25.68,29.41 29.57,29.41 29.95,29.03 v35.74,29.03 | v35.28,43.97 35.28,42.67 34.29,41.68 34.29,40.31 35.74,38.86 v35.74,37.64
N$1  (via drill 0.33)
  Top 0.152: v49.68,42.37 50.29,41.76 50.75,41.76 R1.1 | v56.46,44.27 54.86,44.27 U1.6
  Bottom 0.152: 49.68,44.27 49.68,50.44 50.06,50.83 50.06,51.59 49.38,52.27 48.23,52.27 48.08,52.12 47.47,52.12 46.86,52.73 46.1,52.73 44.96,53.87 44.96,55.17 44.27,55.85 43.51,55.85 41.45,53.8 K1.28 | 49.68,44.27 v49.68,42.37 | 49.68,44.27 v56.46,44.27
N$2
  Top 0.152: U1.5 54.79,45.57 53.65,46.71 52.43,46.71 R2.1 52.35,46.79 52.05,46.79 50.44,48.39 46.94,48.39 45.11,50.22 42.44,50.22 41.45,51.21 K1.27
N$3
  Top 0.152: 53.15,44.16 54.25,43.05 54.79,43.05 U1.7 | 53.15,44.16 53.11,44.2 52.5,44.2 R3.1 | 53.15,44.16 53.19,44.2 53.19,44.42 53.72,44.96 56.01,44.96 56.54,45.49 56.54,47.78 56.77,48.01 57.68,48.01 57.91,47.78 57.91,39.93 57,39.01 CFG.1
N$4
  Top 0.152: FB1.1 10.06,9.98 10.06,4.27 10.29,4.04 J1.2
N$5  (via drill 0.33)
  Top 0.152: FB1.2 10.06,12.04 10.06,14.02 10.97,14.94 C3.1 10.82,15.16 v10.82,16.15 | v9.22,17.75 9.3,17.68 10.59,17.68 11.35,18.44 11.35,18.9 IC1.2
  Bottom 0.152: v10.82,16.15 v9.22,17.75
N$6
  Top 0.152: FB2.1 13.95,9.98 13.95,4.12 13.87,4.04 J1.1
N$7  (via drill 0.33)
  Top 0.152: FB2.2 13.95,12.04 13.95,14.02 13.03,14.94 C3.2 12.95,15.01 12.65,15.32 v12.65,16.15 | v12.65,20.5 12.65,18.97 IC1.3
  Bottom 0.152: v12.65,16.15 v12.65,20.5
N$8
  Top 0.152: FB3.1 20.04,9.98 20.04,4.27 20.27,4.04 J2.2
N$9
  Top 0.152: FB3.2 20.04,12.04 20.04,14.02 20.95,14.94 C2.1 21.03,15.01 21.34,15.32 21.34,18.9 IC2.2
N$10
  Top 0.152: FB4.1 23.93,9.98 23.93,4.12 23.85,4.04 J2.1
N$11
  Top 0.152: FB4.2 23.93,12.04 23.09,12.88 23.09,14.94 C2.2 22.71,15.32 22.71,18.9 IC2.3
N$12
  Top 0.152: FB5.1 30.02,9.98 30.02,4.27 30.25,4.04 J3.2
N$13
  Top 0.152: FB5.2 30.02,12.04 30.02,14.02 30.94,14.94 C4.1 31.01,15.01 31.32,15.32 31.32,18.9 IC3.2
N$14
  Top 0.152: FB6.1 33.98,9.98 33.98,4.19 33.83,4.04 J3.1
N$15
  Top 0.152: FB6.2 33.98,12.04 33.98,14.02 33.07,14.94 C4.2 32.99,15.01 32.69,15.32 32.69,18.9 IC3.3
N$16
  Bottom 0.305: SJ1.3 57.45,10.97 59.97,10.97 60.58,10.36 JP2.2
N$17
  Bottom 0.305: SJ1.1 55.63,11.05 55.63,11.58 60.12,16.08 60.35,16.08 61.42,17.14 61.42,23.77 60.2,24.99 JP10.1
N$18
  Top 0.152: C5.1 33.68,40.54 33.68,40.23 32.99,39.55 32.99,37.87 34.37,36.5 34.37,34.37 33.91,33.91 32.61,33.91 U2.20
N$19  (via drill 0.33)
  Top 0.152: v33.68,55.09 34.44,55.85 50.9,55.85 52.58,54.18 52.58,51.28 55.09,48.77 57.38,48.77 58.22,47.93 58.22,43.2 60.27,41.15 60.35,41.15 62.87,38.63 C8.2 | v26.21,48.69 26.21,48.31 24.31,46.41 24.31,45.57 23.55,44.81 19.2,44.81 18.06,45.95 JP3.DTR
  Bottom 0.152: v33.68,55.09 32.23,53.65 32.23,53.34 31.17,52.27 30.86,52.27 29.72,51.13 29.72,50.83 27.58,48.69 v26.21,48.69
N$20
  Top 0.152: D1.A 17.53,38.18 19.74,38.18 19.81,38.25 R13.1
N$21  (via drill 0.33)
  Top 0.152: v4.8,13.64 4.57,13.41 4.57,12.8 R17.8 | v7.16,15.32 7.92,16.08 D3.C
  Bottom 0.152: v4.8,13.64 5.49,13.64 v7.16,15.32
N$22  (via drill 0.33)
  Top 0.305: v54.18,12.8 54.18,13.95 D2.C | v46.25,21.11 47.24,21.11 47.47,20.88 50.29,20.88 52.96,23.55 Q1.4
  Bottom 0.305: SJ1.2 56.46,10.97 56.46,10.44 56.08,10.06 55.17,10.06 54.18,11.05 v54.18,12.8 54.1,12.88 48.01,12.88 46.25,14.63 v46.25,21.11
N$23
  Top 0.152: R17.7 5.41,12.8 5.41,15.54 5.94,16.08 D4.C
N$24
  Top 0.152: R17.6 6.1,12.72 6.1,12.57 5.71,12.19 4.19,12.19 4.04,12.34 4.04,16.08 D5.C
N$25  (via drill 0.33)
  Top 0.152: v49.38,15.54 49.53,15.54 50.67,16.69 Q1.1
  Bottom 0.152: v49.38,15.54 48.16,15.54 SJ2.2
N$26
  Top 0.152: U2.7 23.93,32.23 22.48,32.23 21.11,30.86 21.11,30.63 Y1.1
N$27
  Top 0.152: U2.8 23.93,31.39 23.93,31.09 23.47,30.63 Y1.3
PB1  (via drill 0.33)
  Top 0.152: v47.47,19.74 47.47,11.96 49,10.44 49,10.21 R8.1 | v35.74,27.89 v37.57,26.06 | v29.34,28.8 28.65,29.49 28.65,29.95 U2.13
  Bottom 0.152: v47.47,19.74 47.47,21.03 47.17,21.34 47.17,21.79 42.9,26.06 v37.57,26.06 | v35.74,27.89 30.25,27.89 v29.34,28.8
PD5  (via drill 0.33)
  Top 0.152: v24.31,28.88 25.38,29.95 U2.9
  Bottom 0.152: v24.31,28.88 21.57,28.88 19.66,26.98 15.01,26.98 12.65,24.61 12.65,23.39 13.56,22.48 46.02,22.48 46.86,21.64 46.86,17.68 48.08,16.46 SJ2.1
PWM  (via drill 0.33)
  Top 0.152: v48.16,13.72 49,12.88 49,11.89 R8.2
  Bottom 0.152: v48.16,13.72 48.16,14.55 SJ2.3 48.23,14.55 52.73,14.55 55.55,17.37 59.82,17.37 JP10.4
PWR
  Top 0.152: R17.5 7.01,12.72 7.54,12.72 8.46,11.81 8.46,11.2 8.15,10.9 1.6,10.9 0.91,11.58 PWR.C
RX  (via drill 0.33)
  Top 0.152: v25.3,40.84 26.98,39.17 26.98,38.56 U2.30 | v14.33,47.85 21.18,47.85 23.01,46.02 JP3.TXO
  Bottom 0.152: v25.3,40.84 14.33,40.84 9.6,45.57 9.6,46.48 10.97,47.85 v14.33,47.85
SCL  (via drill 0.33)
  Top 0.152: R9.1 25.53,41.83 25.83,41.83 28.57,39.09 28.57,38.56 U2.28 28.65,38.48 v28.65,37.34
  Bottom 0.152: 41,47.02 40.62,47.02 39.55,48.08 16.61,48.08 13.49,51.21 K1.5 | 41,47.02 45.95,47.02 J7.1 | v28.65,37.34 29.41,37.34 34.44,32.31 39.47,32.31 41,33.83 41,47.02
SCLK  (via drill 0.33)
  Top 0.152: v15.24,25.07 13.95,25.07 IC1.5 | IC2.5 23.93,25.07 v24.77,25.07 26.06,26.36 33.07,26.36 33.83,25.6 33.83,25.15 IC3.5
  Bottom 0.152: v15.24,25.07 v24.77,25.07 35.28,25.07 36.88,26.67 55.47,26.67 57.99,29.18 57.99,30.1 49.07,39.01 49.07,48.08 47.55,49.61 47.09,49.61 46.63,49.15 38.63,49.15 36.58,51.21 36.35,51.21 K1.23
SDA  (via drill 0.33)
  Top 0.152: 29.53,39.28 29.49,39.24 29.49,38.56 U2.27 | 29.53,39.28 30.56,40.31 30.56,41.83 R4.1 30.63,41.91 31.01,42.29 v31.7,42.29 | v33.07,43.66 33.38,43.36 35.51,43.36 36.04,43.89 39.17,43.89 40.23,44.96 45.95,44.96 J7.2 | v27.36,41.15 27.66,41.15 29.53,39.28
  Bottom 0.152: v31.7,42.29 v33.07,43.66 | v27.36,41.15 26.44,40.23 14.48,40.23 9.3,45.41 9.3,46.63 10.9,48.23 10.9,51.21 K1.3
SENSE  (via drill 0.33)
  Top 0.152: R5.2 51.89,8 51.89,10.06 51.97,10.13 R7.1 51.97,10.21 51.97,10.36 48.77,13.56 v48.77,19.28 | v19.43,35.89 22.02,38.48 25.38,38.48 U2.32 | v45.8,21.87 47.47,21.87 v47.78,21.57
  Bottom 0.152: v19.43,35.89 19.43,31.7 17.75,30.02 9.68,30.02 9.6,30.1 8.38,30.1 7.54,29.26 7.54,28.04 13.72,21.87 v45.8,21.87 | v47.78,21.57 47.78,20.27 v48.77,19.28
TACH
  Top 0.152: R7.2 52.05,11.89 54.94,11.89 R6.1 54.94,11.96 54.94,13.72 58.67,17.45 58.67,18.44 60.12,19.89 JP10.3
TX
  Top 0.152: U2.31 26.21,38.56 26.21,39.09 24.23,41.07 18.06,41.07 14.33,44.81 13.26,44.81 12.34,45.72 12.34,46.63 8.76,50.22 7.47,50.22 7.32,50.37 7.32,52.05 7.54,52.27 9.22,52.27 9.91,51.59 9.91,50.83 13.49,47.24 19.28,47.24 20.5,46.02 JP3.RXI

### Text on the board
Top: TOP
Bottom: BOTTOM
tNames: GND | I2C / GROVE | ANALOG / GROVE | GND | 5V | ADC1 | ADC0 | 3V3 | GND | PWR | + | 12V
bNames: Robosmoker | https://github.com/robosmoker | 2-WIRE | 4-WIRE | 4-WIRE | 2-WIRE